# Altium schematic sheet Boot_section.SchDoc
size A4; SheetNumber: 6; SheetTotal: 6
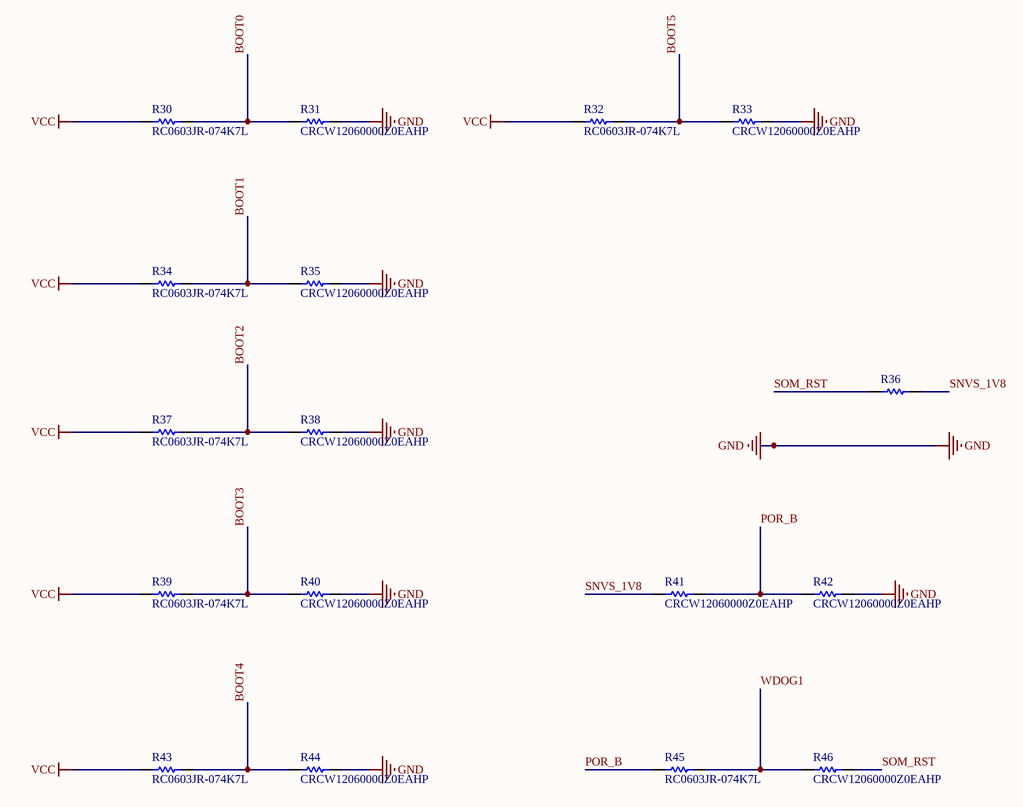
[diagram p0: Boot_section.SchDoc]

## Parts
R30  RC0603JR-074K7L  [RESC1608X55X25ML10T15]
R31  CRCW12060000Z0EAHP  [RESC3116X65X50ML20T20]
R32  RC0603JR-074K7L  [RESC1608X55X25ML10T15]
R33  CRCW12060000Z0EAHP  [RESC3116X65X50ML20T20]
R34  RC0603JR-074K7L  [RESC1608X55X25ML10T15]
R35  CRCW12060000Z0EAHP  [RESC3116X65X50ML20T20]
R36  ERJ-6GEYJ104V  [RESC2013X70X40NL20T20]  (value not drawn)
R37  RC0603JR-074K7L  [RESC1608X55X25ML10T15]
R38  CRCW12060000Z0EAHP  [RESC3116X65X50ML20T20]
R39  RC0603JR-074K7L  [RESC1608X55X25ML10T15]
R40  CRCW12060000Z0EAHP  [RESC3116X65X50ML20T20]
R41  CRCW12060000Z0EAHP  [RESC3116X65X50ML20T20]
R42  CRCW12060000Z0EAHP  [RESC3116X65X50ML20T20]
R43  RC0603JR-074K7L  [RESC1608X55X25ML10T15]
R44  CRCW12060000Z0EAHP  [RESC3116X65X50ML20T20]
R45  RC0603JR-074K7L  [RESC1608X55X25ML10T15]
R46  CRCW12060000Z0EAHP  [RESC3116X65X50ML20T20]

## Nets
GND: R31.2 R33.2 R35.2 R38.2 R40.2 R42.2 R44.2
VCC: R30.2 R32.2 R34.2 R37.2 R39.2 R43.2
BOOT0: R30.1 R31.1
BOOT1: R34.1 R35.1
BOOT2: R37.1 R38.1
BOOT3: R39.1 R40.1
BOOT4: R43.1 R44.1
BOOT5: R32.1 R33.1
POR_B: R41.2 R42.1 R45.2
SNVS_1V8: R36.2 R41.1
SOM_RST: R36.1 R46.2
WDOG1: R45.1 R46.1

## Library data of the parts
R30 R32 R34 R37 R39 R43 R45 = CMP-2000-05024-1: Chip Resistor, 4.7 KOhm, +/- 5%, 100 mW, -55 to 155 degC, 0603 (1608 Metric), RoHS, Tape and Reel; Manufacturer: Yageo; Resistance: 4.7kOhms; Temperature Coefficient: 100PPM/C; Power Rating: 100mW; Voltage Rating: 50V; Operating Temperature Range: -55Cto+155C; Case Code - mm: 1608; Tolerance: 5%; Product: ThickFilmResistorsGeneralPurpose; Case Code - in: 0603; Datasheet URL: http://www.yageo.com/documents/recent/PYu-RC_Group_51_RoHS_L_04.pdf; Package Reference: 603; Datasheet Version: Rev. 4, 02/2016; Package Description: 2-Pin Surface Mount Device, Body 1.6 x 0.8 mm; Manufacturer URL: http://www.yageo.com/; Series: RC; Packaging: Reel; Termination Style: SMD/SMT
R31 R33 R35 R38 R40-R42 R44 R46 = CMP-2003-04873-1: Manufacturer: Vishay Dale; Part Number: CRCW12060000Z0EAHP
R36 = CMP-2001-00338-1: Manufacturer: Panasonic; Part Number: ERJ-6GEYJ104V